# EAGLE design esp12 (EAGLE 6.5.0)
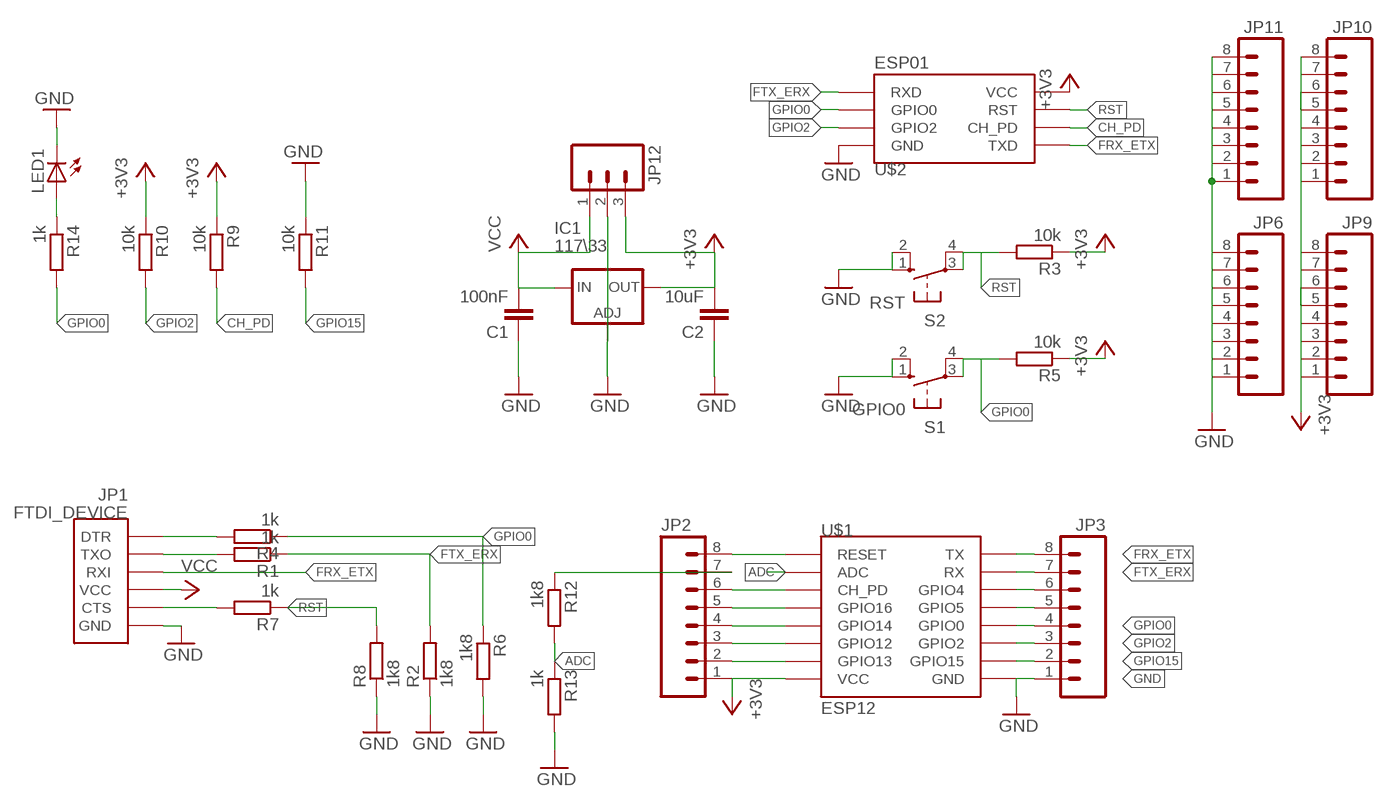
[diagram p0: schematic, sheet 1]

## Parts
C1  100nF  C-EUC1206  [C1206]
C2  10uF  C-EUC1206  [C1206]
IC1  117\33  LD117AS33TR  [SOT223]
JP1  FTDI_DEVICE  [FTDI_DEVICE_SIDE]
JP2  M08  [1X08_ROUND]
JP3  M08  [1X08_ROUND]
JP6  M08  [1X08_ROUND]
JP9  M08  [1X08_ROUND]
JP10  M08  [1X08_ROUND]
JP11  M08  [1X08_ROUND]
JP12  M03PTH  [1X03]
LED1  LEDSMT1206  [1206]
R1  1k  R-EU_M1206  [M1206]
R2  1k8  R-EU_M1206  [M1206]
R3  10k  R-EU_M1206  [M1206]
R4  1k  R-EU_M1206  [M1206]
R5  10k  R-EU_M1206  [M1206]
R6  1k8  R-EU_M1206  [M1206]
R7  1k  R-EU_M1206  [M1206]
R8  1k8  R-EU_M1206  [M1206]
R9  10k  R-EU_M1206  [M1206]
R10  10k  R-EU_M1206  [M1206]
R11  10k  R-EU_M1206  [M1206]
R12  1k8  R-EU_M1206  [M1206]
R13  1k  R-EU_M1206  [M1206]
R14  1k  R-EU_M1206  [M1206]
S1  GPIO0  10-XX  [B3F-10XX]
S2  RST  10-XX  [B3F-10XX]
U$1  ESP12  [ESP12]
U$2  ESP01  [ESP01]

## Nets
+3V3: C2.2 IC1.4(OUT) JP2.1 JP9.1 JP9.2 JP9.3 JP9.4 JP9.5 JP9.6 JP9.7 JP9.8 JP10.1 JP10.2 JP10.3 JP10.4 JP10.5 JP10.6 JP10.7 JP10.8 JP12.3 R3.1 R5.1 R9.1 R10.1 U$1.VCC U$2.VCC
ADC: R12.2 R13.1 U$1.ADC
CH_PD: JP2.6 R9.2 U$1.CH_PD U$2.CH_PD
FRX_ETX: JP1.P$3(RXI) JP3.8 U$1.TX U$2.TX(TXD)
FTX_ERX: JP3.7 R1.1 R2.2 U$1.RX U$2.RX(RXD)
GND: C1.1 C2.1 IC1.1(ADJ) JP1.P$6(GND) JP3.1 JP6.1 JP6.2 JP6.3 JP6.4 JP6.5 JP6.6 JP6.7 JP6.8 JP11.1 JP11.2 JP11.3 JP11.4 JP11.5 JP11.6 JP11.7 JP11.8 JP12.2 LED1.C R2.1 R6.2 R8.1 R11.1 R13.2 S1.1(S) S1.2(S1) S2.1(S) S2.2(S1) U$1.GND U$2.GND
GPIO0: JP3.4 R4.1 R5.2 R6.1 R14.2 S1.3(P) S1.4(P1) U$1.GPIO0 U$2.GPIO0
GPIO2: JP3.3 R10.2 U$1.GPIO2 U$2.GPIO2
GPIO15: JP3.2 R11.2 U$1.GPIO15
N$1: JP1.P$5(CTS) R7.2
N$2: JP1.P$2(TXO) R1.2
N$3: JP2.2 U$1.GPIO13
N$4: JP2.3 U$1.GPIO12
N$5: JP2.4 U$1.GPIO14
N$6: JP1.P$1(DTR) R4.2
N$7: JP2.5 U$1.GPIO16
N$8: LED1.A R14.1
N$9: JP2.7 R12.1
N$14: JP3.5 U$1.GPIO5
N$15: JP3.6 U$1.GPIO4
RST: JP2.8 R3.2 R7.1 R8.2 S2.3(P) S2.4(P1) U$1.RESET U$2.RST
VCC: C1.2 IC1.3(IN) JP1.P$4(VCC) JP12.1

## Library data of the parts
C1 C2 = resistor:C-EU: CAPACITOR, European symbol
IC1 = v-reg:LD117A?*: Low drop fixed and adjustable positive voltage regulators 1 A Source: http://www.st.com/stonline/products/literature/ds/7194/ld1117axx.pdf
JP1 = SparkFun-Connectors:FTDI_DEVICE: Connector which mates to FTDI basic or FTDI cable.
JP2 JP3 JP6 JP9-JP11 = SparkFun-Connectors:M08: Header 8 Standard 8-pin 0.1" header. Use with straight break away headers (SKU : PRT-00116), right angle break away headers (PRT-00553), swiss pins (PRT-00743), machine pins (PRT-00117), and female headers (PRT-00115).
JP12 = SparkFun-Connectors:M03: Header 3 Standard 3-pin 0.1" header. Use with straight break away headers (SKU : PRT-00116), right angle break away headers (PRT-00553), swiss pins (PRT-00743), machine pins (PRT-00117), and female headers (PRT-00115). Molex polarized connector foot print use with SKU : PRT-08232 with associated crimp pins and housings.
LED1 = led:LED: LED OSRAM: - CHIPLED LG R971, LG N971, LY N971, LG Q971, LY Q971, LO R971, LY R971 LH N974, LH R974 LS Q976, LO Q976, LY Q976 LO Q996 - Hyper CHIPLED LW Q18S LB Q993, LB Q99A, LB R99A - SideLED LS A670, LO A670, LY A670, LG A670, LP A670 LB A673, LV A673, LT A673, LW A673 LH A674 LY A675 LS A676, LA A676, LO A676, LY A676, LW A676 LS A679, LY A679, LG A679 - Hyper Micro SIDELED® LS Y876, LA Y876, LO Y876, LY Y876 LT Y87S - SmartLED LW L88C, LW L88S LB L89C, LB L89S, LG L890 LS L89K, LO L89K, LY L89K LS L896, LA L896, LO L896, LY L896 - TOPLED LS T670, LO T670, LY T670, LG T670, LP T670 LSG T670, LSP T670, LSY T670, LOP T670, LYG T670 LG T671, LOG T671, LSG T671 LB T673, LV T673, LT T673, LW T673 LH T674 LS T676, LA T676, LO T676, LY T676, LB T676, LH T676, LSB T676, LW T676 LB T67C, LV T67C, LT T67C, LS T67K, LO T67K, LY T67K, LW E67C LS E67B, LA E67B, LO E67B, LY E67B, LB E67C, LV E67C, LT E67C LW T67C LS T679, LY T679, LG T679 LS T770, LO T770, LY T770, LG T770, LP T770 LB T773, LV T773, LT T773, LW T773 LH T774 LS E675, LA E675, LY E675, LS T675 LS T776, LA T776, LO T776, LY T776, LB T776 LHGB T686 LT T68C, LB T68C - Hyper Mini TOPLED® LB M676 - Mini TOPLED Santana® LG M470 LS M47K, LO M47K, LY M47K Source: http://www.osram.convergy.de LUXEON: - LUMILED® LXK2-PW12-R00, LXK2-PW12-S00, LXK2-PW14-U00, LXK2-PW14-V00 LXK2-PM12-R00, LXK2-PM12-S00, LXK2-PM14-U00 LXK2-PE12-Q00, LXK2-PE12-R00, LXK2-PE12-S00, LXK2-PE14-T00, LXK2-PE14-U00 LXK2-PB12-K00, LXK2-PB12-L00, LXK2-PB12-M00, LXK2-PB14-N00, LXK2-PB14-P00, LXK2-PB14-Q00 LXK2-PR12-L00, LXK2-PR12-M00, LXK2-PR14-Q00, LXK2-PR14-R00 LXK2-PD12-Q00, LXK2-PD12-R00, LXK2-PD12-S00 LXK2-PH12-R00, LXK2-PH12-S00 LXK2-PL12-P00, LXK2-PL12-Q00, LXK2-PL12-R00 Source: www.luxeon.com KINGBRIGHT: KA-3528ASYC Source: www.kingbright.com
R1-R14 = resistor:R-EU_: RESISTOR, European symbol
S1 S2 = switch-omron:10-XX: OMRON SWITCH; MPN: B3F-1000; OC_FARNELL: 176432; OC_NEWARK: 36M3542
U$1 = esp8266modules:ESP12: ESP8266 Wifi module 12
U$2 = esp8266modules:ESP01: ESP8266 Wifi module 01

## Board
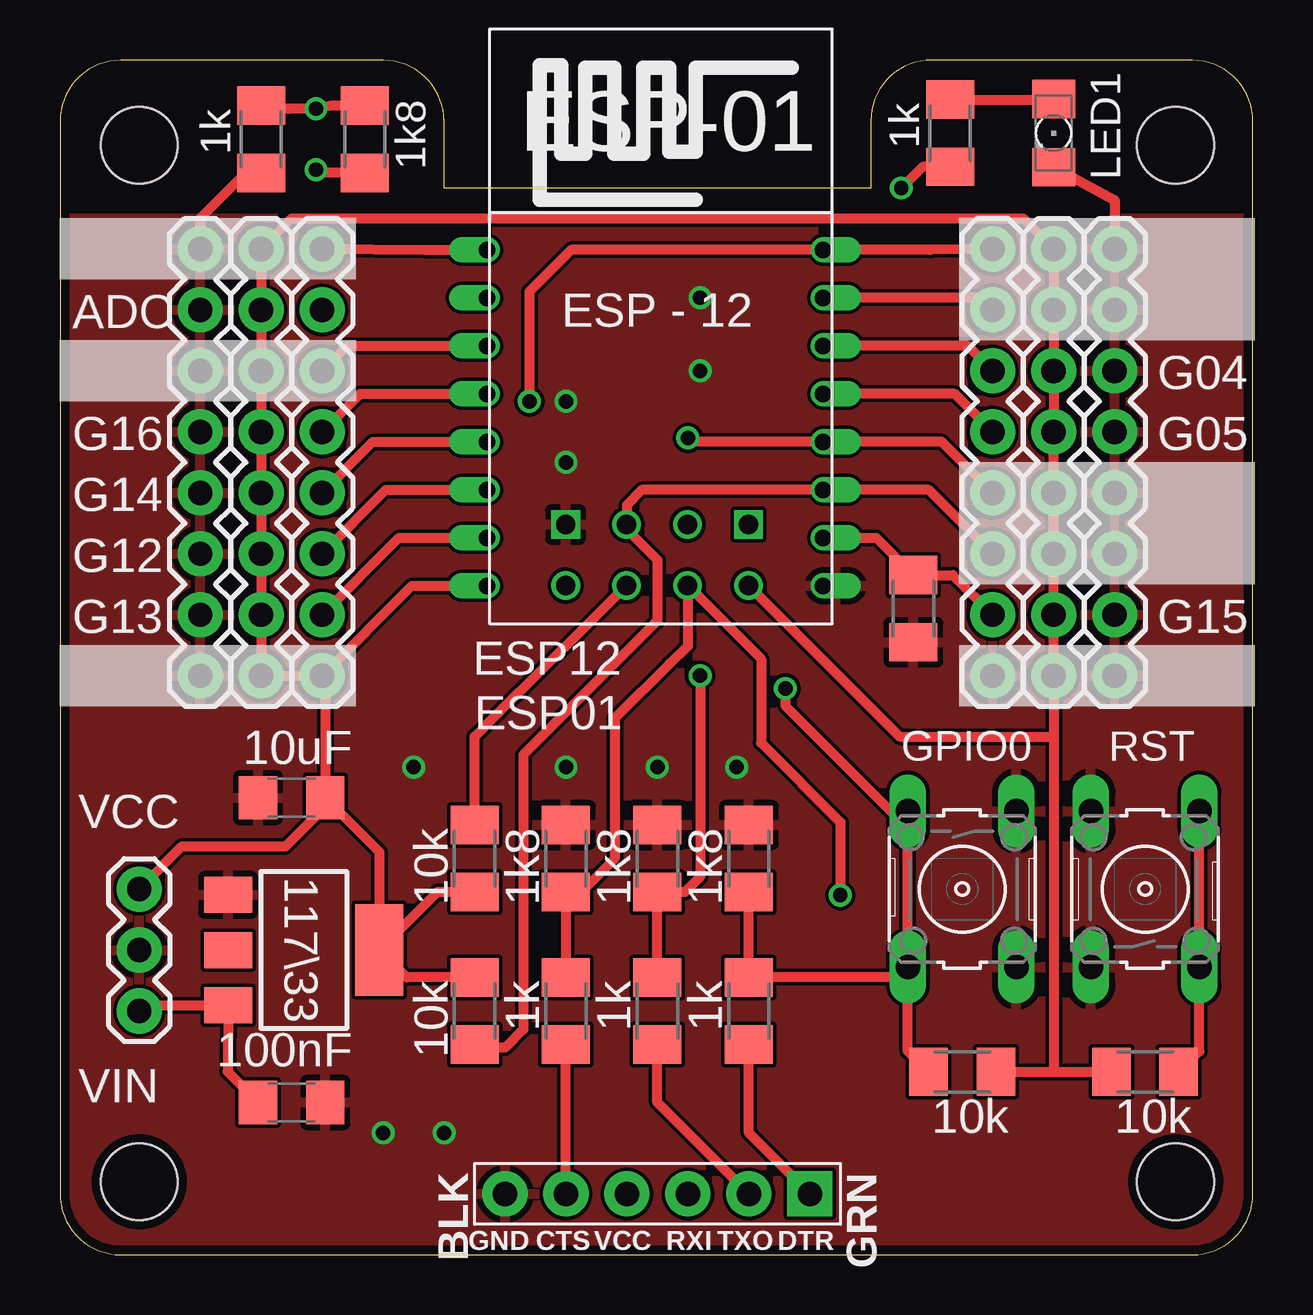
[diagram p1: board, top side]
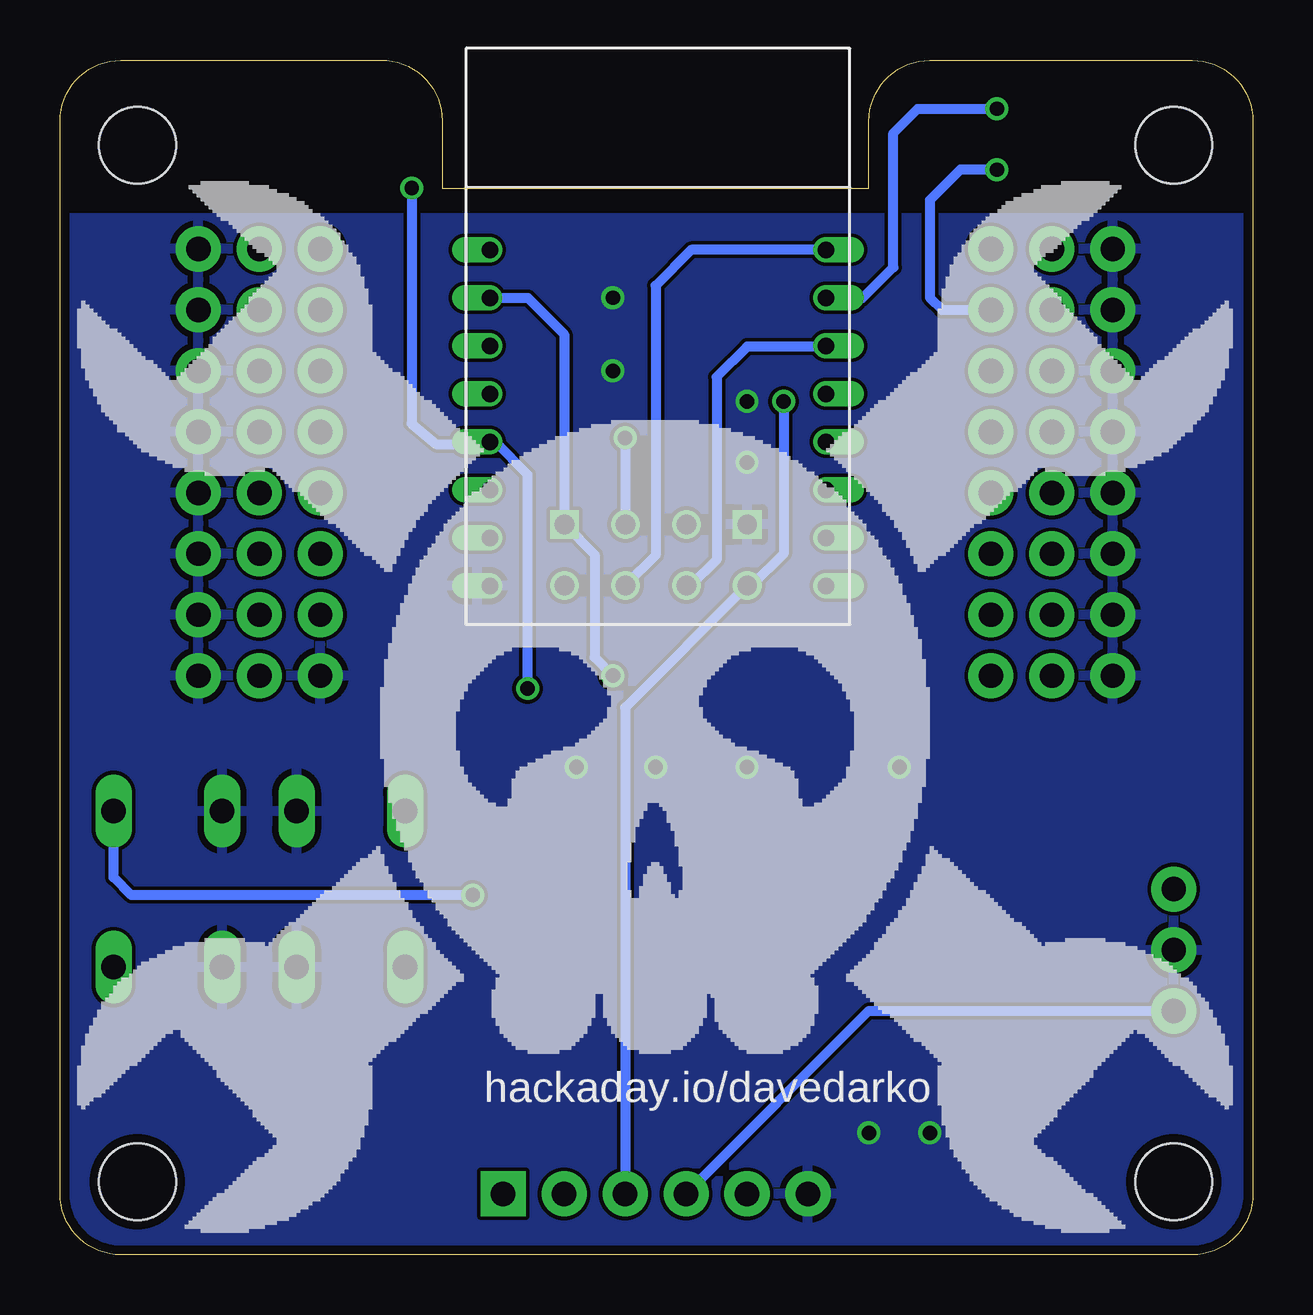
[diagram p2: board, bottom side, seen from below]

Size 49.71 x 49.78 mm. Coordinates in mm from the lower left corner, seen from the top.
Outline: 0,47.23 0,2.54 arc90 2.54,0 47.17,0 arc90 49.71,2.54 49.71,47.23 arc90 47.17,49.77 36.83,49.78 36.32,49.78 arc90 33.78,47.24 33.78,44.45 16,44.45 16,47.23 arc90 13.46,49.77 2.54,49.77 arc90 0,47.23
Copper layers (1*16): Top 0.0356mm / dielectric 1.5011mm / Bottom 0.0356mm
Design rules "LaenPCBOrder *": minimum track width 6mil, minimum drill 13mil, track to track 6mil, track to pad 6mil, pad to pad 6mil, via to via 6mil, smd to smd 6mil, copper to edge 15mil, drill to drill 6mil, minimum pad ring 7mil, minimum via ring 7mil, stop-mask expansion 3mil, vias tented up to drill 200mil, thermal gap 10mil
Holes 3.2 mm at 3.3,46.23 46.48,46.23 3.3,3.05 46.48,3.05

### Footprints (pad centres in the part's own frame; a part is rotated, then mirrored left to right if it is on the bottom)
C1206 = smd 1.6 x 1.8: 1 -1.4,0; 2 1.4,0
SOT223 = smd 1.5 x 2: 1 -2.3,-3.15; 2 0,-3.15; 3 2.3,-3.15 | smd 3.8 x 2: 4 0,3.15
FTDI_DEVICE_SIDE = drill 1.016 pad 1.88 square: P$1 -6.35,0 | drill 1.016 pad 1.88: P$2 -3.81,0; P$3 -1.27,0; P$4 1.27,0; P$5 3.81,0; P$6 6.35,0
1X08_ROUND = drill 1.016 pad 1.88: 1 0,0; 2 2.54,0; 3 5.08,0; 4 7.62,0; 5 10.16,0; 6 12.7,0; 7 15.24,0; 8 17.78,0
1X03 = drill 1.016 pad 1.88: 1 0,0; 2 2.54,0; 3 5.08,0
1206 = smd 1.6 x 1.803: A -1.422,0; C 1.422,0
M1206 = smd 1.6 x 2: 1 -1.4,0; 2 1.4,0
B3F-10XX = drill 1.016 long: 1 -3.251,2.261; 2 3.251,2.261; 3 -3.251,-2.261; 4 3.251,-2.261
ESP12 = drill 0.7 offset: ADC -7.1,3.8; CH_PD -7.1,1.8; GND 6.9,-8.2; GPIO0 6.9,-2.2; GPIO2 6.9,-4.2; GPIO4 6.9,1.8; GPIO5 6.9,-0.2; GPIO12 -7.1,-4.2; GPIO13 -7.1,-6.2; GPIO14 -7.1,-2.2; GPIO15 6.9,-6.2; GPIO16 -7.1,-0.2; RESET -7.1,5.8; RX 6.9,3.8; TX 6.9,5.8; VCC -7.1,-8.2
ESP01 = drill 0.8: CH_PD -1.285,-8.178; GPIO0 1.255,-5.638; GPIO2 -1.285,-5.638; RST 1.255,-8.178; TX -3.825,-8.178; VCC 3.795,-8.178 | drill 0.8 square: GND -3.825,-5.638; RX 3.795,-5.638

### Placement (x,y rotation side)
C1  9.65,6.35 180 top
C2  9.65,19.05 0 top
IC1  10.16,12.7 270 top
JP1  24.89,2.54 180 top
JP2  10.92,24.13 90 top
JP3  38.86,24.13 90 top
JP6  5.84,24.13 90 top
JP9  8.38,24.13 90 top
JP10  41.4,24.13 90 top
JP11  43.94,24.13 90 top
JP12  3.3,10.16 90 top
LED1  41.4,46.74 270 top
R1  24.89,10.16 270 top
R2  24.89,16.51 270 top
R3  45.21,7.62 0 top
R4  28.7,10.16 270 top
R5  37.59,7.62 180 top
R6  28.7,16.51 90 top
R7  21.08,10.16 270 top
R8  21.08,16.51 270 top
R9  17.27,16.51 90 top
R10  17.27,10.16 270 top
R11  35.56,26.92 90 top
R12  12.7,46.48 90 top
R13  8.38,46.48 270 top
R14  37.08,46.74 270 top
S1  37.59,15.24 270 top
S2  45.21,15.24 90 top
U$1  24.89,36.07 0 top
U$2  24.89,36.07 0 top

### Tracks (layer width: path | path; a pad name or v marks a point on that pad's centre or on a via)
+3V3
  Top 0.406: JP2.1 14.66,27.87 U$1.VCC | JP2.1 JP9.1 JP9.2 JP9.3 JP9.4 JP9.5 JP9.6 JP9.7 JP9.8 9.65,43.18 40.13,43.18 JP10.8 JP10.7 JP10.6 JP10.5 JP10.4 JP10.3 JP10.2 JP10.1 41.4,21.59 | JP2.1 11.05,24 C2.2 | C2.2 13.31,16.79 IC1.4 | R5.1 41.4,7.62 | 41.4,7.62 R3.1 | 41.4,21.59 41.4,7.62 | JP12.3 5.08,17.02 9.4,17.02 11.05,18.67 C2.2 | U$2.VCC 34.99,21.59 41.4,21.59 | R10.1 14.45,11.56 IC1.4 | R9.1 15.72,15.11 IC1.4
ADC  (via drill 0.6)
  Top 0.406: R13.1 9.53,47.75 v10.67,47.75 11.31,47.88 R12.2
  Bottom 0.406: U$1.ADC 16.27,39.87 14.99,41.15 14.99,46.74 13.97,47.75 v10.67,47.75
CH_PD
  Top 0.406: JP2.6 11.96,37.87 U$1.CH_PD | R9.2 17.27,21.59 18.29,22.61 21.88,26.16 U$2.CH_PD
  Bottom 0.406: U$1.CH_PD 17.81,37.85 21.08,37.85 22.35,36.58 22.35,28.96 23.42,27.89 U$2.CH_PD
FRX_ETX  (via drill 0.6)
  Top 0.406: JP3.8 36.28,41.87 U$1.TX 21.29,41.87 19.56,40.13 v19.56,35.56
  Bottom 0.406: JP1.P$3 26.16,22.8 U$2.TX 20.88,27.89 19.56,29.21 v19.56,35.56
FTX_ERX  (via drill 0.6)
  Top 0.406: JP3.7 38.36,39.87 U$1.RX | R1.1 R2.2 26.03,15.11 26.67,15.75 v26.67,24.13
  Bottom 0.406: U$1.RX 30.22,39.87 28.7,38.35 28.7,30.45 U$2.RX 27.43,29.18 27.43,24.89 v26.67,24.13
GND  (via drill 0.6)
  Top 0.406: R13.2 7.74,45.08 5.84,43.18 JP6.8 | LED1.C 43.94,43.94 JP11.8
  other vias: 21.08,33.02 26.67,36.83 26.67,39.88 21.08,35.56 16,5.08 13.46,5.08 21.08,20.32 24.89,20.32 28.19,20.32 14.73,20.32
  pour Top: -4.32,43.18 54.1,43.18 54.1,-2.54 -4.32,-2.54
  pour Bottom: -1.78,43.18 51.56,43.18 51.56,-5.08 -1.78,-5.08
GPIO0  (via drill 0.6)
  Top 0.406: JP3.4 36.74,33.87 U$1.GPIO0 26.33,33.87 v26.16,34.04 | R6.1 R4.1 35.16,11.56 S1.4 | S1.4 35.33,17.78 | 35.33,17.78 S1.3 | R5.2 35.33,8.48 S1.4 | v30.23,23.6 30.23,22.89 35.33,17.78 | R14.2 35.94,45.34 v35.05,44.45
  Bottom 0.406: v26.16,34.04 26.16,30.45 U$2.GPIO0 | v30.23,23.6 30.23,32.51 31.58,33.87 U$1.GPIO0 32.13,33.78 34.04,33.78 35.05,34.63 v35.05,44.45
GPIO2
  Top 0.406: JP3.3 36.2,31.87 U$1.GPIO2 24.25,31.87 23.62,31.24 23.62,30.45 U$2.GPIO2 23.61,30.24 24.89,28.96 24.89,26.42 19.3,20.83 19.3,9.4 18.54,8.64 17.4,8.64 R10.2
GPIO15
  Top 0.406: U$1.GPIO15 34.02,29.87 R11.2 37.21,28.32 JP3.2
N$1
  Top 0.406: JP1.P$5 R7.2
N$2
  Top 0.406: JP1.P$2 24.89,6.35 R1.2
N$3
  Top 0.406: JP2.2 14.12,29.87 U$1.GPIO13
N$4
  Top 0.406: JP2.3 13.58,31.87 U$1.GPIO12
N$5
  Top 0.406: JP2.4 13.04,33.87 U$1.GPIO14
N$6
  Top 0.406: JP1.P$1 28.7,5.08 R4.2
N$7
  Top 0.406: JP2.5 12.5,35.87 U$1.GPIO16
N$8
  Top 0.406: R14.1 41.31,48.14 LED1.A
N$9  (via drill 0.6)
  Top 0.406: R12.1 10.8,45.08 v10.67,45.21
  Bottom 0.406: v10.67,45.21 12.19,45.21 13.46,43.94 13.46,39.88 12.95,39.37 JP2.7
N$14
  Top 0.406: JP3.5 37.28,35.87 U$1.GPIO5
N$15
  Top 0.406: JP3.6 37.82,37.87 U$1.GPIO4
RST  (via drill 0.6)
  Top 0.406: JP2.8 15.2,41.87 U$1.RESET | R7.1 R8.2 21.71,15.11 23.11,16.51 23.11,22.35 25.4,24.64 26.16,25.37 U$2.RST 29.21,24.83 29.21,21.34 32.51,18.03 v32.51,14.99 | R3.2 47.47,8.48 S2.3 S2.4
  Bottom 0.406: U$1.RESET 23.41,41.87 24.89,40.39 24.89,29.14 U$2.RST | v32.51,14.99 46.74,14.99 47.47,15.72 S2.4
VCC
  Top 0.406: JP12.1 3.54,10.4 IC1.3 6.99,7.63 C1.2
  Bottom 0.406: JP1.P$4 16,10.16 JP12.1

### Text on the board
tNames: ADC | G04 | G16 | G05 | G14 | G12 | G13 | G15 | VCC | VIN
bNames: hackaday.io/davedarko
tStop: RST | TX | RX | CHP | G00 | G02 | VCC | GND